# Altium schematic sheet Kandidat.SchDoc
size A4
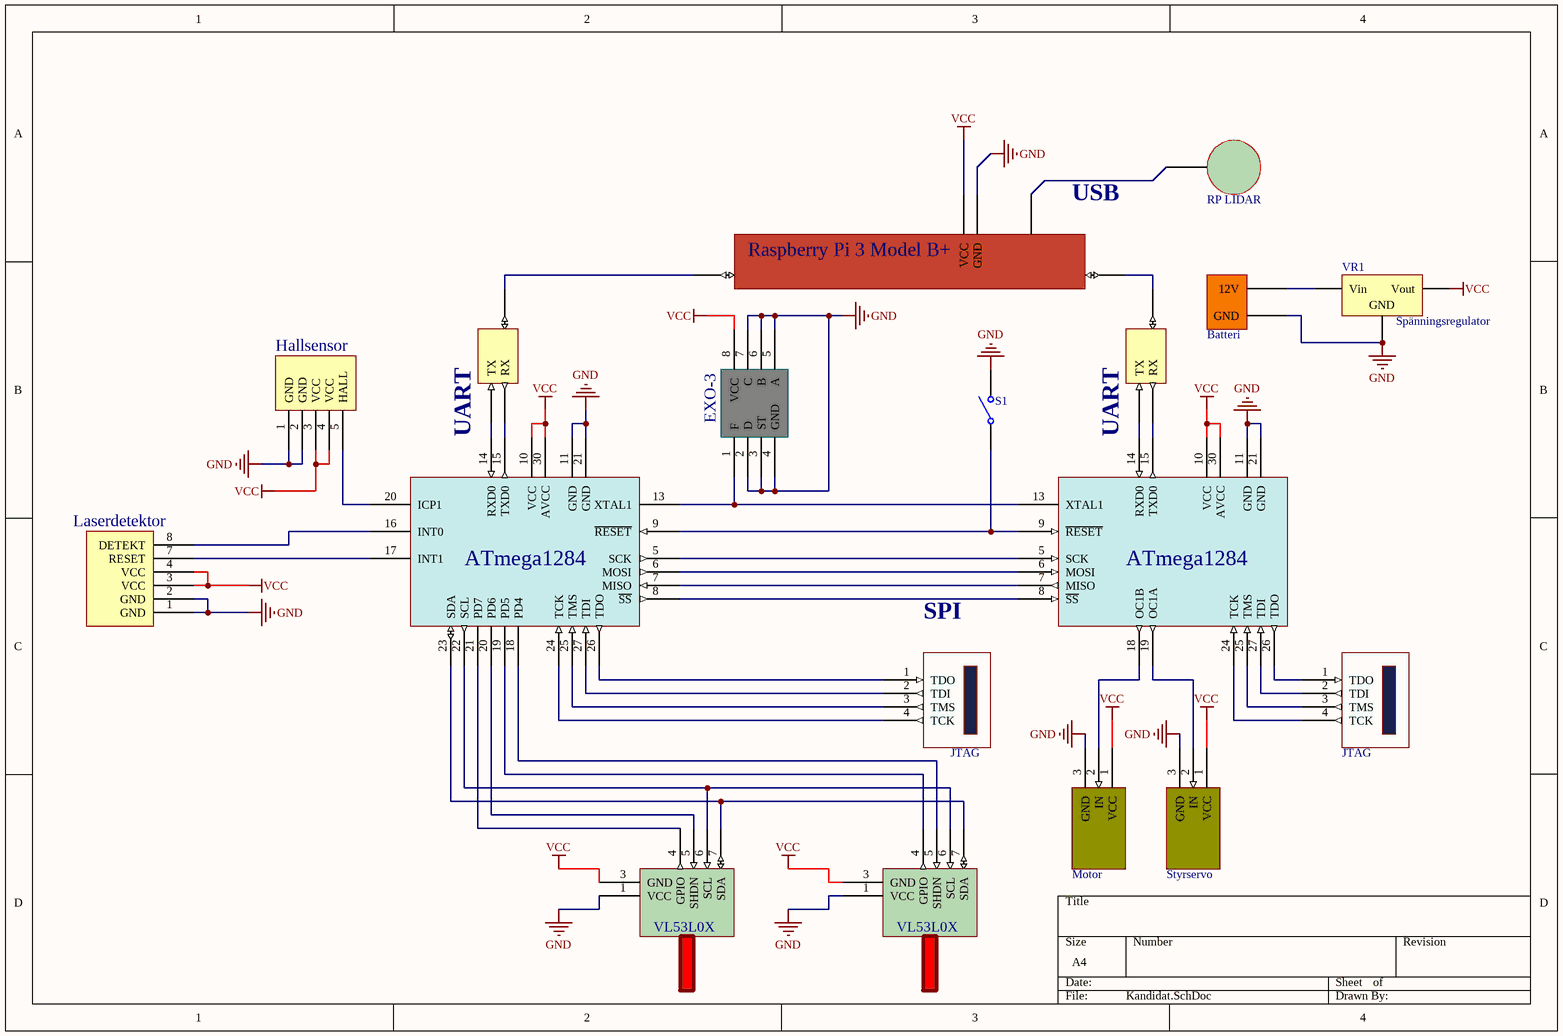
[diagram p0: Kandidat.SchDoc]

## Parts
3  JTAG
4  JTAG
14  Styrservo
15  Motor
21  RP LIDAR
23  Batteri
56  VL53L0X
76  VL53L0X
123  usb->uart  (value not drawn)
312  usb->uart  (value not drawn)
657  EXO-3
1233  Raspberry Pi 3 Model B+
2345  Laserdetektor
3475  Hallsensor
44235  ATmega1284
56324  ATmega1284
S1  SW-SPST  [SPST-2]  (value not drawn)
VR1  Spänningsregulator  [D2PAK_N]

## Nets
GND: 14.3(GND) 15.3(GND) 23.55(GND) 56.1(VCC) 76.1(VCC) 657.2(D) 657.3(ST) 657.4(GND) 657.5(A) 657.6(B) 657.7(C) 1233.40(GND) 2345.1(GND) 2345.2(GND) 3475.1(GND) 3475.2(GND) 44235.11(GND) 44235.21(GND) 56324.11(GND) 56324.21(GND) S1.2(NO) VR1.2(GND)
VCC: 14.1(VCC) 15.1(VCC) 56.3(GND) 76.3(GND) 657.8(VCC) 1233.39(VCC) 2345.3(VCC) 2345.4(VCC) 3475.3(VCC) 3475.4(VCC) 44235.10(VCC) 44235.30(AVCC) 56324.10(VCC) 56324.30(AVCC) VR1.3(Vout)
Net3_1: 3.1(TDO) 56324.26(TDO)
Net3_2: 3.2(TDI) 56324.27(TDI)
Net3_3: 3.3(TMS) 56324.25(TMS)
Net3_4: 3.4(TCK) 56324.24(TCK)
Net4_1: 4.1(TDO) 44235.26(TDO)
Net4_2: 4.2(TDI) 44235.27(TDI)
Net4_3: 4.3(TMS) 44235.25(TMS)
Net4_4: 4.4(TCK) 44235.24(TCK)
Net14_2: 14.2(IN) 44235.19(OC1A)
Net15_2: 15.2(IN) 44235.18(OC1B)
Net23_54: 23.54(12V) VR1.1(Vin)
Net56_4: 56.4(GPIO) 56324.21(PD7)
Net56_5: 56.5(SHDN) 56324.20(PD6)
Net56_6: 56.6(SCL) 76.6(SCL) 56324.22(SCL)
Net56_7: 56.7(SDA) 76.7(SDA) 56324.23(SDA)
Net76_4: 76.4(GPIO) 56324.19(PD5)
Net76_5: 76.5(SHDN) 56324.18(PD4)
Net123_42: 123.42(RX) 44235.15(TXD0)
Net123_43: 123.43(TX) 44235.14(RXD0)
Net123_44: 123.44 1233.35(TX2)
Net312_42: 312.42(RX) 56324.15(TXD0)
Net312_43: 312.43(TX) 56324.14(RXD0)
Net312_44: 312.44 1233.34(TX1)
Net657_1: 657.1(F) 44235.13(XTAL1) 56324.13(XTAL1)
Net2345_7: 2345.7(RESET) 56324.17(INT1)
Net2345_8: 2345.8(DETEKT) 56324.16(INT0)
Net3475_5: 3475.5(HALL) 56324.20(ICP1)
Net44235_5: 44235.5(SCK) 56324.5(SCK)
Net44235_6: 44235.6(MOSI) 56324.6(MOSI)
Net44235_7: 44235.7(MISO) 56324.7(MISO)
Net44235_8: 44235.8(~{SS}) 56324.8(~{SS})
Net44235_9: 44235.9(~{RESET}) 56324.9(~{RESET}) S1.1(COMMON)

Not connected (* = marked no-connect by the designer): 21 39; 1233 38

## Notes on the sheet
- (near 1233) USB
- (near 312) UART
- (near 123) UART
- SPI

## Library data of the parts
44235 = ATmega1284styr
56324 = ATmega1284Sens
S1 = SW-SPST: Single-Pole, Single-Throw Switch; Published: 24-Mar-1999; LatestRevisionDate: 17-Jul-2002; LatestRevisionNote: Re-released for DXP Platform.; PackageReference: SPST-2; Publisher: Altium Limited; PackageDescription: Switch; 2 Leads
VR1 = Volt Reg: Voltage Regulator; Published: 24-Mar-1999; LatestRevisionDate: 29-May-2009; LatestRevisionNote: IPC-7351 Footprint Added.; PackageReference: D2PAK; Publisher: Altium Limited; PackageDescription: 3-Pin Transistor Outline Package 2.54 mm Pitch, 15.1 mm Lead Span